# Altium schematic sheet Probe Connections.SchDoc
size A4; SheetNumber: 1; SheetTotal: 2
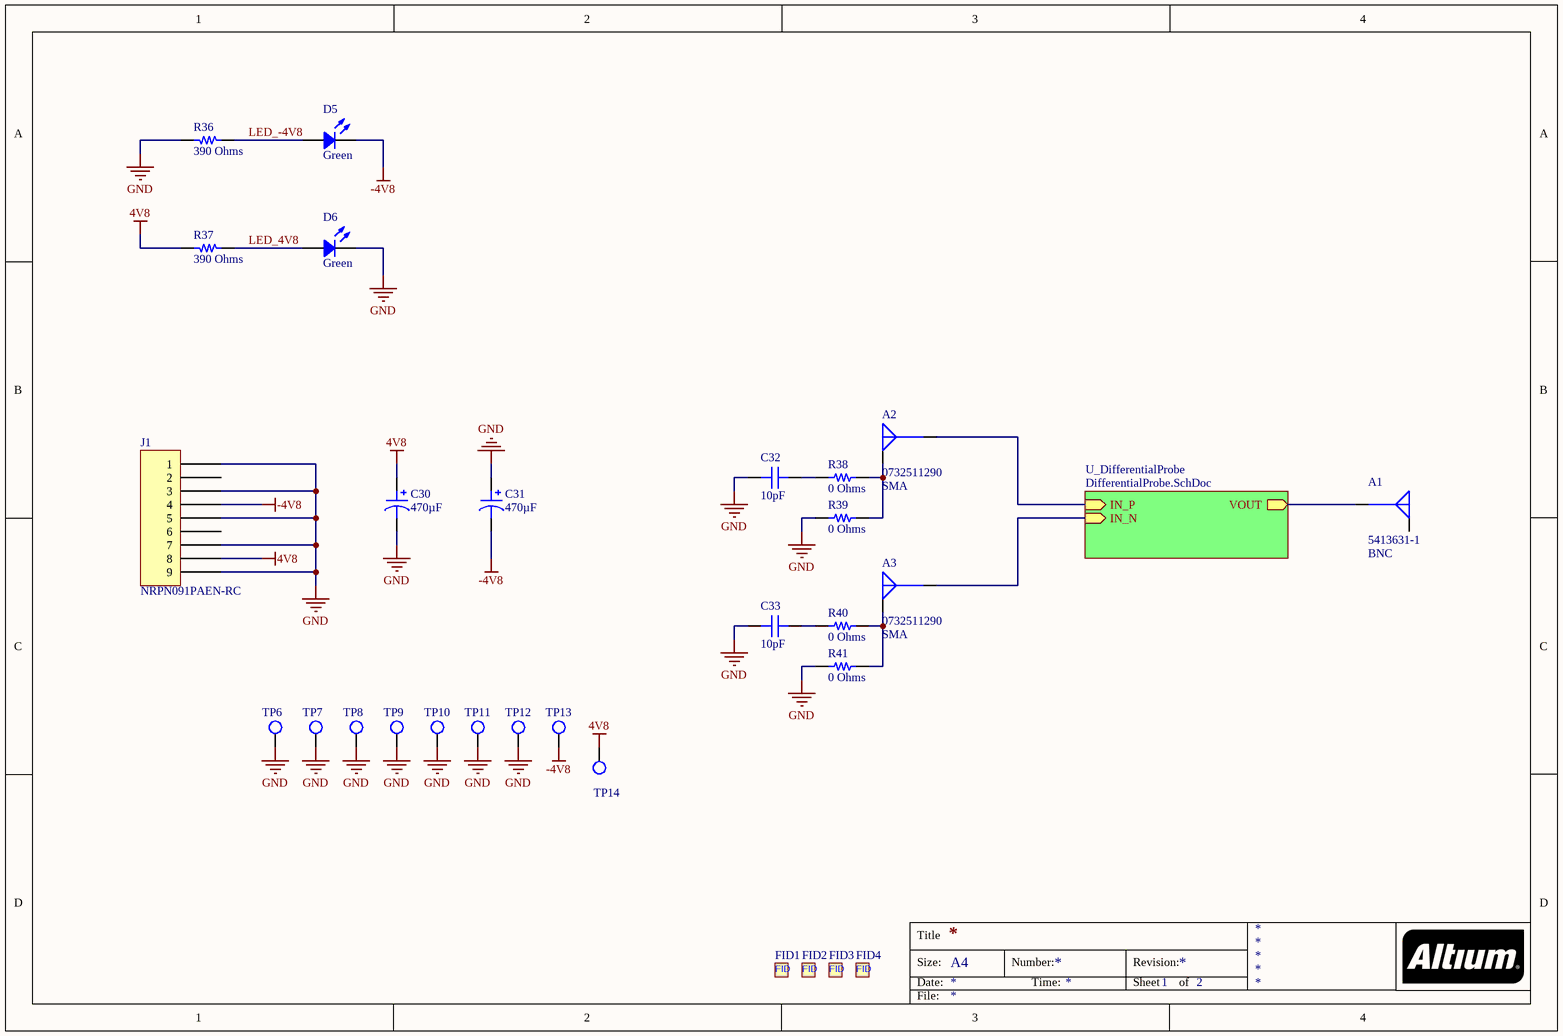
[diagram p0: Probe Connections.SchDoc]

## Parts
A1  5413631-1  Connector Style: BNC  [TE 5413631-1]
A2  0732511290  Connector Style: SMA  [MOLEX SD-73251-129]
A3  0732511290  Connector Style: SMA  [MOLEX SD-73251-129]
C30  470µF  [CAP POL 2917_7343]
C31  470µF  [CAP POL 2917_7343]
C32  10pF  [CAP 1206_3216 - 1.0MM]
C33  10pF  [CAP 1206_3216 - 1.0MM]
D5  Green  [LED 0805_2012 GREEN]
D6  Green  [LED 0805_2012 GREEN]
FID1  Fiducial  [Fiducial-1mm]  (value not drawn)
FID2  Fiducial  [Fiducial-1mm]  (value not drawn)
FID3  Fiducial  [Fiducial-1mm]  (value not drawn)
FID4  Fiducial  [Fiducial-1mm]  (value not drawn)
J1  NRPN091PAEN-RC  [SULLINS NRPN091PAEN-RC]
R36  390 Ohms  [RES 0805_2012]
R37  390 Ohms  [RES 0805_2012]
R38  0 Ohms  [RES 1206_3216]
R39  0 Ohms  [RES 1206_3216]
R40  0 Ohms  [RES 1206_3216]
R41  0 Ohms  [RES 1206_3216]
TP6  Test Point  [TestPoint-1.5mm]  (value not drawn)  (no BOM)
TP7  Test Point  [TestPoint-1.5mm]  (value not drawn)  (no BOM)
TP8  Test Point  [TestPoint-1.5mm]  (value not drawn)  (no BOM)
TP9  Test Point  [TestPoint-1.5mm]  (value not drawn)  (no BOM)
TP10  Test Point  [TestPoint-1.5mm]  (value not drawn)  (no BOM)
TP11  Test Point  [TestPoint-1.5mm]  (value not drawn)  (no BOM)
TP12  Test Point  [TestPoint-1.5mm]  (value not drawn)  (no BOM)
TP13  Test Point  [TestPoint-1.5mm]  (value not drawn)  (no BOM)
TP14  Test Point  [TestPoint-1.5mm]  (value not drawn)  (no BOM)

## Sub-sheets
U_DifferentialProbe = DifferentialProbe.SchDoc: VOUT (out), IN_P (in), IN_N (in)

## Nets
4V8: C30.1 J1.8 R37.2 TP14.1(TP)
-4V8: C31.2 D5.2 J1.4 TP13.1(TP)
GND: C30.2 C31.1 C32.1 C33.1 D6.2 J1.1 J1.3 J1.5 J1.7 J1.9 R36.2 R39.1 R41.1 TP6.1(TP) TP7.1(TP) TP8.1(TP) TP9.1(TP) TP10.1(TP) TP11.1(TP) TP12.1(TP)
LED_4V8: D6.1 R37.1
LED_-4V8: D5.1 R36.1
NetA1_S: A1.S ; sheet U_DifferentialProbe/VOUT
NetA2_G: A2.G R38.2 R39.2
NetA2_S: A2.S ; sheet U_DifferentialProbe/IN_P
NetA3_G: A3.G R40.2 R41.2
NetA3_S: A3.S ; sheet U_DifferentialProbe/IN_N
NetC32_2: C32.2 R38.1
NetC33_2: C33.2 R40.1

Not connected (* = marked no-connect by the designer): A1 G; J1 2 6

## Notes on the sheet
- Title
- Size:
- Date:
- A4
- Number:
- Time:
- Revision:
- Sheet
- of
- File:
- (in symbol CMP-002-000000-1) FID

## Library data of the parts
A1 = 5413631-1: CONN BNC JACK R/A 50 OHM PCB; Manufacturer: TE Connectivity AMP Connectors; Connector Type: Jack, Female Socket; Contact Termination: Solder; Frequency - Max: 4 GHz; Impedance: 50Ohm; Number of Ports: 1; Part Number: 5413631-1; ComponentLink1Description: Datasheet; ComponentLink1URL: https://www.te.com/commerce/DocumentDelivery/DDEController?Action=srchrtrv&DocNm=1307191_BNC_Connectors&DocType=CS&DocLang=English; ComponentLink2Description: DigiKey Link; ComponentLink2URL: https://www.digikey.com/en/products/detail/te-connectivity-amp-connectors/5413631-1/811168; Fastening Type: Bayonet Lock; Housing Color: Silver; LastUpdated: 29/06/2022 18:00:52; Lifecycle Status: Active; Minimum Order: 1; Mounting Type: Through Hole, Right Angle; Packaging: Bulk; Part Status: Active; Price: 5.77; Series: -; Shield Termination: Solder; Supplier 1: DigiKey; Supplier Part Number 1: A32270-ND
A2 A3 = 0732511290: CONN SMA JACK STR 50OHM EDGE MNT; Manufacturer: Molex; Connector Type: Jack, Female Socket; Contact Termination: Solder; Frequency - Max: 18 GHz; Number of Ports: 1; Part Number: 0732511290; ComponentLink1Description: Datasheet; ComponentLink1URL: https://www.molex.com/pdm_docs/ps/PS-89675-346.pdf; ComponentLink2Description: DigiKey Link; ComponentLink2URL: https://www.digikey.com/en/products/detail/molex/0732511290/3878247; Fastening Type: Threaded; Housing Color: Gold; Impedance: 50Ohm; LastUpdated: 29/06/2022 18:07:55; Lifecycle Status: Active; Minimum Order: 1; Mounting Feature: Bulkhead - Front Side Nut; Mounting Type: Board Edge, End Launch; Panel Mount; Packaging: Tray; Part Status: Active; Price: 4.46; Series: 73251; Shield Termination: Solder; Supplier 1: DigiKey; Supplier Part Number 1: WM9461-ND
C30 C31 = TPSE477K010R0100: CAP TANT 470UF 10% 10V 2917; manufacturer: AVX Corporation; Manufacturer Size Code: E; ESR (Equivalent Series Resistance): 100mOhm; Type: Molded; Part Number: TPSE477K010R0100; Value: 470µF; Capacitance: 470µF; componentlink1description: Datasheet; componentlink1url: http://datasheets.avx.com/TPS.pdf; componentlink2description: DigiKey Link; componentlink2url: http://digikey.com/product-detail/en/avx-corporation/TPSE477K010R0100/478-1807-1-ND/564839; Device Package: 2917 (7343 Metric); Features: General Purpose; Height - Seated (Max): 0.169" (4.30mm); lastupdated: 02/09/2020 01:16:18; Lifecycle Status: Active; Minimum Order: 1; Mounting Type: Surface Mount; Operating Temperature: -55°C ~ 125°C; Package / Case: 2917 (7343 Metric); packaging: TapeAndReel; partid: 1906; Part Status: Active; price: 1.10; series: TPS; Size / Dimension: 0.287" L x 0.169" W (7.30mm x 4.30mm); Supplier 1: DigiKey; Supplier Part Number 1: 478-1807-1-ND; Tolerance: ±10%; Voltage - Rated: 10V
C32 C33 = 1206GA100JAT2A: CAP CER 10PF 2KV C0G/NP0 1206; manufacturer: AVX Corporation; Temperature Coefficient: C0G, NP0; Tolerance: ±5%; Voltage - Rated: 2000V (2kV); Part Number: 1206GA100JAT2A; Value: 10pF; Applications: General Purpose; Capacitance: 10pF; componentlink1description: Datasheet; componentlink1url: http://datasheets.avx.com/AVX-HV_MLCC.pdf; componentlink2description: DigiKey Link; componentlink2url: http://digikey.com/product-detail/en/avx-corporation/1206GA100JAT2A/478-10697-1-ND/7536569; Device Package: 1206 (3216 Metric); Features: High Voltage; lastupdated: 02/09/2020 01:05:04; Lifecycle Status: Active; Minimum Order: 1; Mounting Type: Surface Mount, MLCC; Operating Temperature: -55°C ~ 125°C; Package / Case: 1206 (3216 Metric); packaging: TapeAndReel; partid: 19364; Part Status: Active; price: 0.29; series: -; Size / Dimension: 0.130" L x 0.063" W (3.30mm x 1.60mm); Supplier 1: DigiKey; Supplier Part Number 1: 478-10697-1-ND; Thickness (Max): 0.037" (0.94mm)
D5 D6 = APHCM2012CGCK-F01: LED GREEN CLEAR CHIP SMD; Manufacturer: Kingbright; Configuration: Standard; Current - Test: 20mA; Lens Color: Colorless; Lens Size: 1.30mm x 1.25mm; Lens Style: Rectangle with Flat Top; Millicandela Rating: 50mcd; Viewing Angle: 110°; Voltage - Forward (Vf) (Typ): 2.1V; Wavelength - Dominant: 570nm; Wavelength - Peak: 574nm; Part Number: APHCM2012CGCK-F01; Color: Green; ComponentLink1Description: Datasheet; ComponentLink1URL: http://www.kingbrightusa.com/images/catalog/SPEC/APHCM2012CGCK-F01.pdf; ComponentLink2Description: DigiKey Link; ComponentLink2URL: https://www.digikey.com/en/products/detail/kingbright/APHCM2012CGCK-F01/1747492; Device Package: 0805 (2012 Metric); Height (Max): 0.40mm; LastUpdated: 20/06/2022 12:31:45; Lens Transparency: Clear; Lifecycle Status: Active; Minimum Order: 1; Mounting Type: Surface Mount; Package / Case: 0805 (2012 Metric); Packaging: TapeAndReel; PartId: 241; Part Status: Active; Price: 0.06; Series: -; Size / Dimension: 2.00mm L x 1.25mm W; Supplier 1: DigiKey; Supplier Part Number 1: 754-1094-1-ND; Supplier Device Package: Chip LED; Value: Green
FID1-FID4 = CMP-002-000000-1: Design Item ID: Fiducial; Component Type: Standard; Source: Fiducial.SchLib; Pin Count: 0
J1 = NRPN091PAEN-RC: CONN HEADER VERT 9POS 2MM; Manufacturer: Sullins Connector Solutions; Contact Length - Mating: 0.141" (3.60mm); Contact Length - Post: 0.110" (2.79mm); Current Rating (Amps): 2A; Material Flammability Rating: UL94 V-0; Number of Positions: 9; Number of Positions Loaded: All; Overall Contact Length: 0.331" (8.40mm); Pitch - Mating: 0.079" (2.00mm); Row Spacing - Mating: -40°C ~ 105°C; Shrouding: Unshrouded; Style: Board to Board or Cable; Part Number: NRPN091PAEN-RC; ComponentLink1Description: Datasheet; ComponentLink1URL: https://drawings-pdf.s3.amazonaws.com/10531.pdf; ComponentLink2Description: DigiKey Link; ComponentLink2URL: https://www.digikey.com/en/products/detail/sullins-connector-solutions/NRPN091PAEN-RC/804922; Connector Type: Header; Contact Finish - Mating: Gold; Contact Finish - Post: Gold; Contact Finish Thickness - Mating: Flash; Contact Material: Brass; Contact Shape: Square; Contact Type: Male Pin; Fastening Type: Push-Pull; Insulation Color: Black; Insulation Height: 0.079" (2.00mm); Insulation Material: Polyamide (PA6T), Nylon 6T; LastUpdated: 29/06/2022 18:29:44; Lifecycle Status: Active; Minimum Order: 1; Mounting Type: Through Hole; Number of Rows: 1; Operating Temperature: -40°C ~ 105°C; Packaging: Bulk; PartId: 136; Part Status: Active; Price: 0.27; Series: -; Supplier 1: DigiKey; Supplier Part Number 1: S5800-09-ND; Termination: Solder
R36 R37 = CRG0805F390R: RES SMD 390 OHM 1% 1/8W 0805; Manufacturer: TE Connectivity Passive Product; Power (Watts): 0.125W, 1/8W; Temperature Coefficient: ±100ppm/°C; Part Number: CRG0805F390R; Value: 390 Ohms; ComponentLink1Description: Datasheet; ComponentLink1URL: https://www.te.com/commerce/DocumentDelivery/DDEController?Action=srchrtrv&DocNm=1773204&DocType=DS&DocLang=English; ComponentLink2Description: DigiKey Link; ComponentLink2URL: https://www.digikey.com/en/products/detail/te-connectivity-passive-product/CRG0805F390R/2380897; Composition: Thick Film; Device Package: 0805 (2012 Metric); Height - Seated (Max): 0.026" (0.65mm); LastUpdated: 20/06/2022 12:21:16; Lifecycle Status: Active; Minimum Order: 1; Number of Terminations: 2; Operating Temperature: -55°C ~ 155°C; Package / Case: 0805 (2012 Metric); Packaging: TapeAndReel; PartId: 46128; Part Status: Active; Price: 0.01; Resistance: 390 Ohms; Series: CRG, Neohm; Size / Dimension: 0.079" L x 0.049" W (2.00mm x 1.25mm); Supplier 1: DigiKey; Supplier Part Number 1: A126365CT-ND; Supplier Device Package: 0805; Tolerance: ±1%
R38-R41 = RC1206JR-100RL: RES 0 OHM JUMPER 1/4W 1206; Manufacturer: Yageo; Power (Watts): 0.25W, 1/4W; Part Number: RC1206JR-100RL; ComponentLink1Description: Datasheet; ComponentLink1URL: https://www.yageo.com/upload/media/product/productsearch/datasheet/rchip/PYu-RC_Group_51_RoHS_L_11.pdf; ComponentLink2Description: DigiKey Link; ComponentLink2URL: https://www.digikey.com/en/products/detail/yageo/RC1206JR-100RL/13694179; Composition: Thick Film; Device Package: 1206 (3216 Metric); Features: Moisture Resistant; Height - Seated (Max): 0.026" (0.65mm); LastUpdated: 29/06/2022 14:19:15; Lifecycle Status: Active; Minimum Order: 1; Number of Terminations: 2; Operating Temperature: -55°C ~ 155°C; Package / Case: 1206 (3216 Metric); Packaging: TapeAndReel; PartId: 58659; Part Status: Active; Price: 0.01; Resistance: 0 Ohms; Series: RC_L; Size / Dimension: 0.122" L x 0.063" W (3.10mm x 1.60mm); Supplier 1: DigiKey; Supplier Part Number 1: 13-RC1206JR-100RLCT-ND; Supplier Device Package: 1206; Tolerance: Jumper; Value: 0 Ohms
TP6-TP14 = CMP-003-000000-1: Component Type: Standard (No BOM); Source: Test Point.SchLib; Design Item ID: Test Point; Pin Count: 1